# Altium schematic sheet sensors.SchDoc
size A4
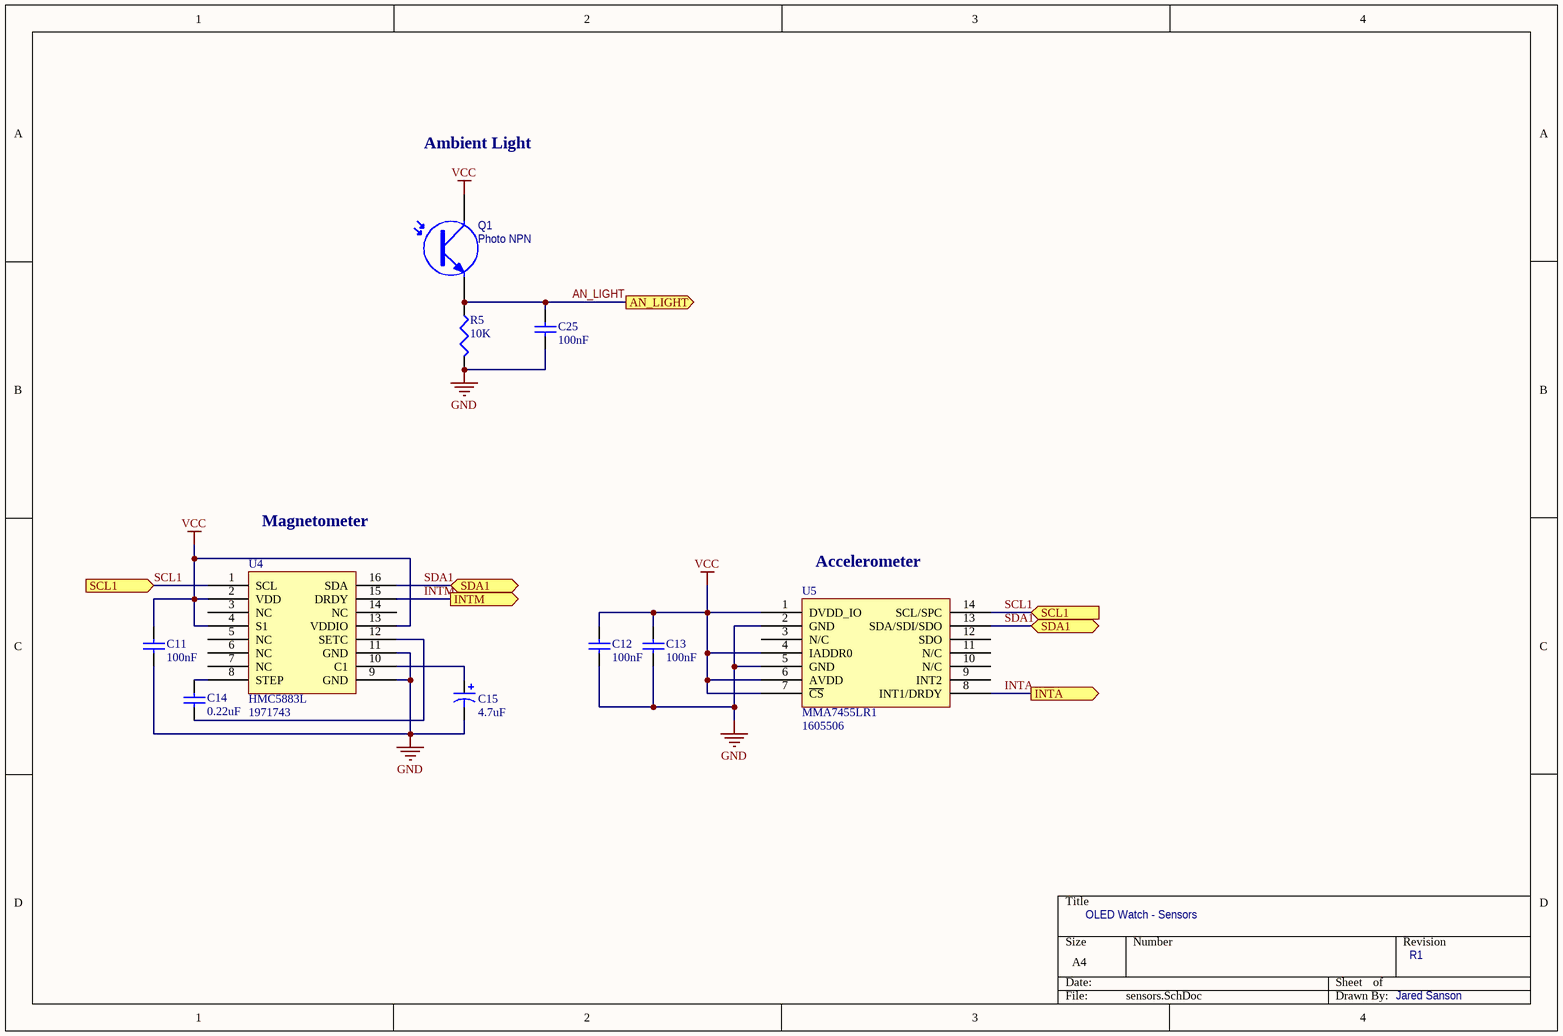
[diagram p0: sensors.SchDoc]

## Parts
C11  value 100nF  [0603C]  (hidden comment: Cap)
C12  value 100nF  [0603C]  (hidden comment: Cap)
C13  value 100nF  [0603C]  (hidden comment: Cap)
C14  value 0.22uF  [0603C]  (hidden comment: Cap)
C15  value 4.7uF  [0805C]  (hidden comment: Cap Pol1)
C25  value 100nF  [0603C]  (hidden comment: Cap)
Q1  Photo NPN  [TEMT6000]
R5  value 10K  [0603R]  (hidden comment: Res3)
U4  HMC5883L  Supplier Part Number 1: 1971743  [HMC5883L_16PINQFN]
U5  MMA7455LR1  Supplier Part Number 1: 1605506  [LGA80P500X300-14N]

## Ports
AN_LIGHT (out), INTA (out), INTM (out), SCL1 (in), SDA1 (bidir)

## Nets
GND: C11.2 C12.2 C13.2 C15.2 C25.2 R5.2 U4.9(GND) U4.11(GND) U5.2(GND) U5.5(GND)
VCC: C11.1 C12.1 C13.1 Q1.1(C) U4.2(VDD) U4.4(S1) U4.13(VDDIO) U5.1(DVDD_IO) U5.4(IADDR0) U5.6(AVDD) U5.7(~{CS})
AN_LIGHT: C25.1 Q1.3(E) R5.1 ; port AN_LIGHT
INTA: U5.8(INT1/DRDY) ; port INTA
INTM: U4.15(DRDY) ; port INTM
SCL1: U4.1(SCL) U5.14(SCL/SPC) ; port SCL1
SDA1: U4.16(SDA) U5.13(SDA/SDI/SDO) ; port SDA1
NetC14_1: C14.1 U4.12(SETC)
NetC14_2: C14.2 U4.8(STEP)
NetC15_1: C15.1 U4.10(C1)

Not connected (* = marked no-connect by the designer): U4 3(NC) 5(NC) 6(NC) 7(NC) 14(NC); U5 3(N/C) 9(INT2) 10(N/C) 11(N/C) 12(SDO)

## Notes on the sheet
- Ambient Light
- Magnetometer
- (near U5) Accelerometer
- OLED Watch - Sensors
- R1
- Jared Sanson

## Library data of the parts
C11-C14 C25 = Cap: Capacitor; Published: 8-Jun-2000; LatestRevisionDate: 17-Jul-2002; LatestRevisionNote: Re-released for DXP Platform.; PackageReference: RAD-0.3; Publisher: Altium Limited; PackageDescription: Radial Cap, Thru-Hole; 2 Leads; 0.3 in Pin Spacing
C15 = Cap Pol1: Polarized Capacitor (Radial); Published: 8-Jun-2000; LatestRevisionDate: 17-Jul-2002; LatestRevisionNote: Re-released for DXP Platform.; PackageReference: RB7.6-15; Publisher: Altium Limited; PackageDescription: Polarized Capacitor (Radial); 2 Leads
Q1 = Photo NPN: NPN Phototransistor; Published: 24-Mar-1999; LatestRevisionDate: 17-Jul-2002; LatestRevisionNote: Re-released for DXP Platform.; PackageReference: TO-220_A; Publisher: Altium Limited; Code_JEDEC: TO-220-AC
R5 = Res3: Resistor; Published: 8-Jun-2000; LatestRevisionDate: 29-May-2009; LatestRevisionNote: IPC-7351 Footprint Added.; PackageReference: J1-0603; Publisher: Altium Limited; PackageDescription: Chip Resistor
U4 = HMC5883L: Honeywell 3 Axis Magnetometer; Manufacturer: HONEYWELL M&PS; Manufacturer Part Number: HMC5883L-TR; Description: HONEYWELL M&PS - HMC5883L-TR - SENSOR, MAGNETIC, 3AXIS, 16 PIN; Magnetic Field Min: -8; Magnetic Field Max: 8; Resolution (Gauss): 0.005; Interface Type: I2; Magnetometer Range: -8G to 8; Supply Voltage Range: 2.16V DC to 3.6; Supplier 1: Farnell; RoHS: YES; Stock 1: 526; Pricing 1: 1=3.61, 5=3.43, 10=3.28, 25=3.09 (NZD); Operating Temperature Max: 85; Operating Temperature Min: -30; Operating Temperature Range: -30°C to +85; ComponentLink1URL: http://www.farnell.com/datasheets/1683374.pdf; ComponentLink1Description: http://www.farnell.com/datasheets/1683374.pdf
U5 = MMA7455LR1: 3-Axis Accelerometer, 5g; Manufacturer: FREESCALE SEMICONDUCTOR; Description: FREESCALE SEMICONDUCTOR - MMA7455LR1 - IC, 3-AXIS DIGITAL 2, 4, 8G, 14-LGA; MEMS Sensor Output: Digital; Measurement Axis: X, Y, Z; Acceleration Range: ± 2g, ± 4g, ± 8; Supply Voltage Min: 2.4; Supply Voltage Max: 3.6; Sensor Case Style: LGA; No. of Pins: 14; Sensitivity Min: 58counts/g, 29counts/g, 14.5; Sensitivity Typ: 16counts/g, 32counts/g, 64; Sensitivity Max: 70counts/g, 35counts/g, 17.5; SVHC: No SVHC (19-Dec-2012); Amplifier Type: Accelerometer Sensor X-Y-Z axis; Interface Type: I2; No. of Bits: 10; No. of Channels: 3; Supply Current: 400; Supply Voltage Range: 2.4V to 3.6; Supplier 1: Farnell; Manufacturer Part Number: MMA7455LR1; RoHS: YES; Stock 1: 19; Pricing 1: 1=4.24, 25=4.19, 100=4.11, 1000=3.67 (NZD); MSL: MSL 3 - 168 hours; Operating Temperature Max: 85; Operating Temperature Min: -40; Operating Temperature Range: -40°C to +85; Package / Case: LGA; Supply Voltage DC Max: 3.6; Supply Voltage DC Min: 2.4; Termination Type: SMD; ComponentLink1URL: http://www.freescale.com/files/sensors/doc/data_sheet/MMA7455L.pdf; ComponentLink1Description: http://www.freescale.com/files/sensors/doc/data_sheet/MMA7455L.pdf